# Altium schematic sheet I2C_Keypad.SchDoc
size B; Author: AM; CompanyName: Expatria Technologies; DrawnBy: A.Marles; Engineer: AM; Organization: Expatria Technologies; DocumentNumber: 13; Revision: A1; SheetNumber: 13; SheetTotal: 14; PCB_Rev: A1
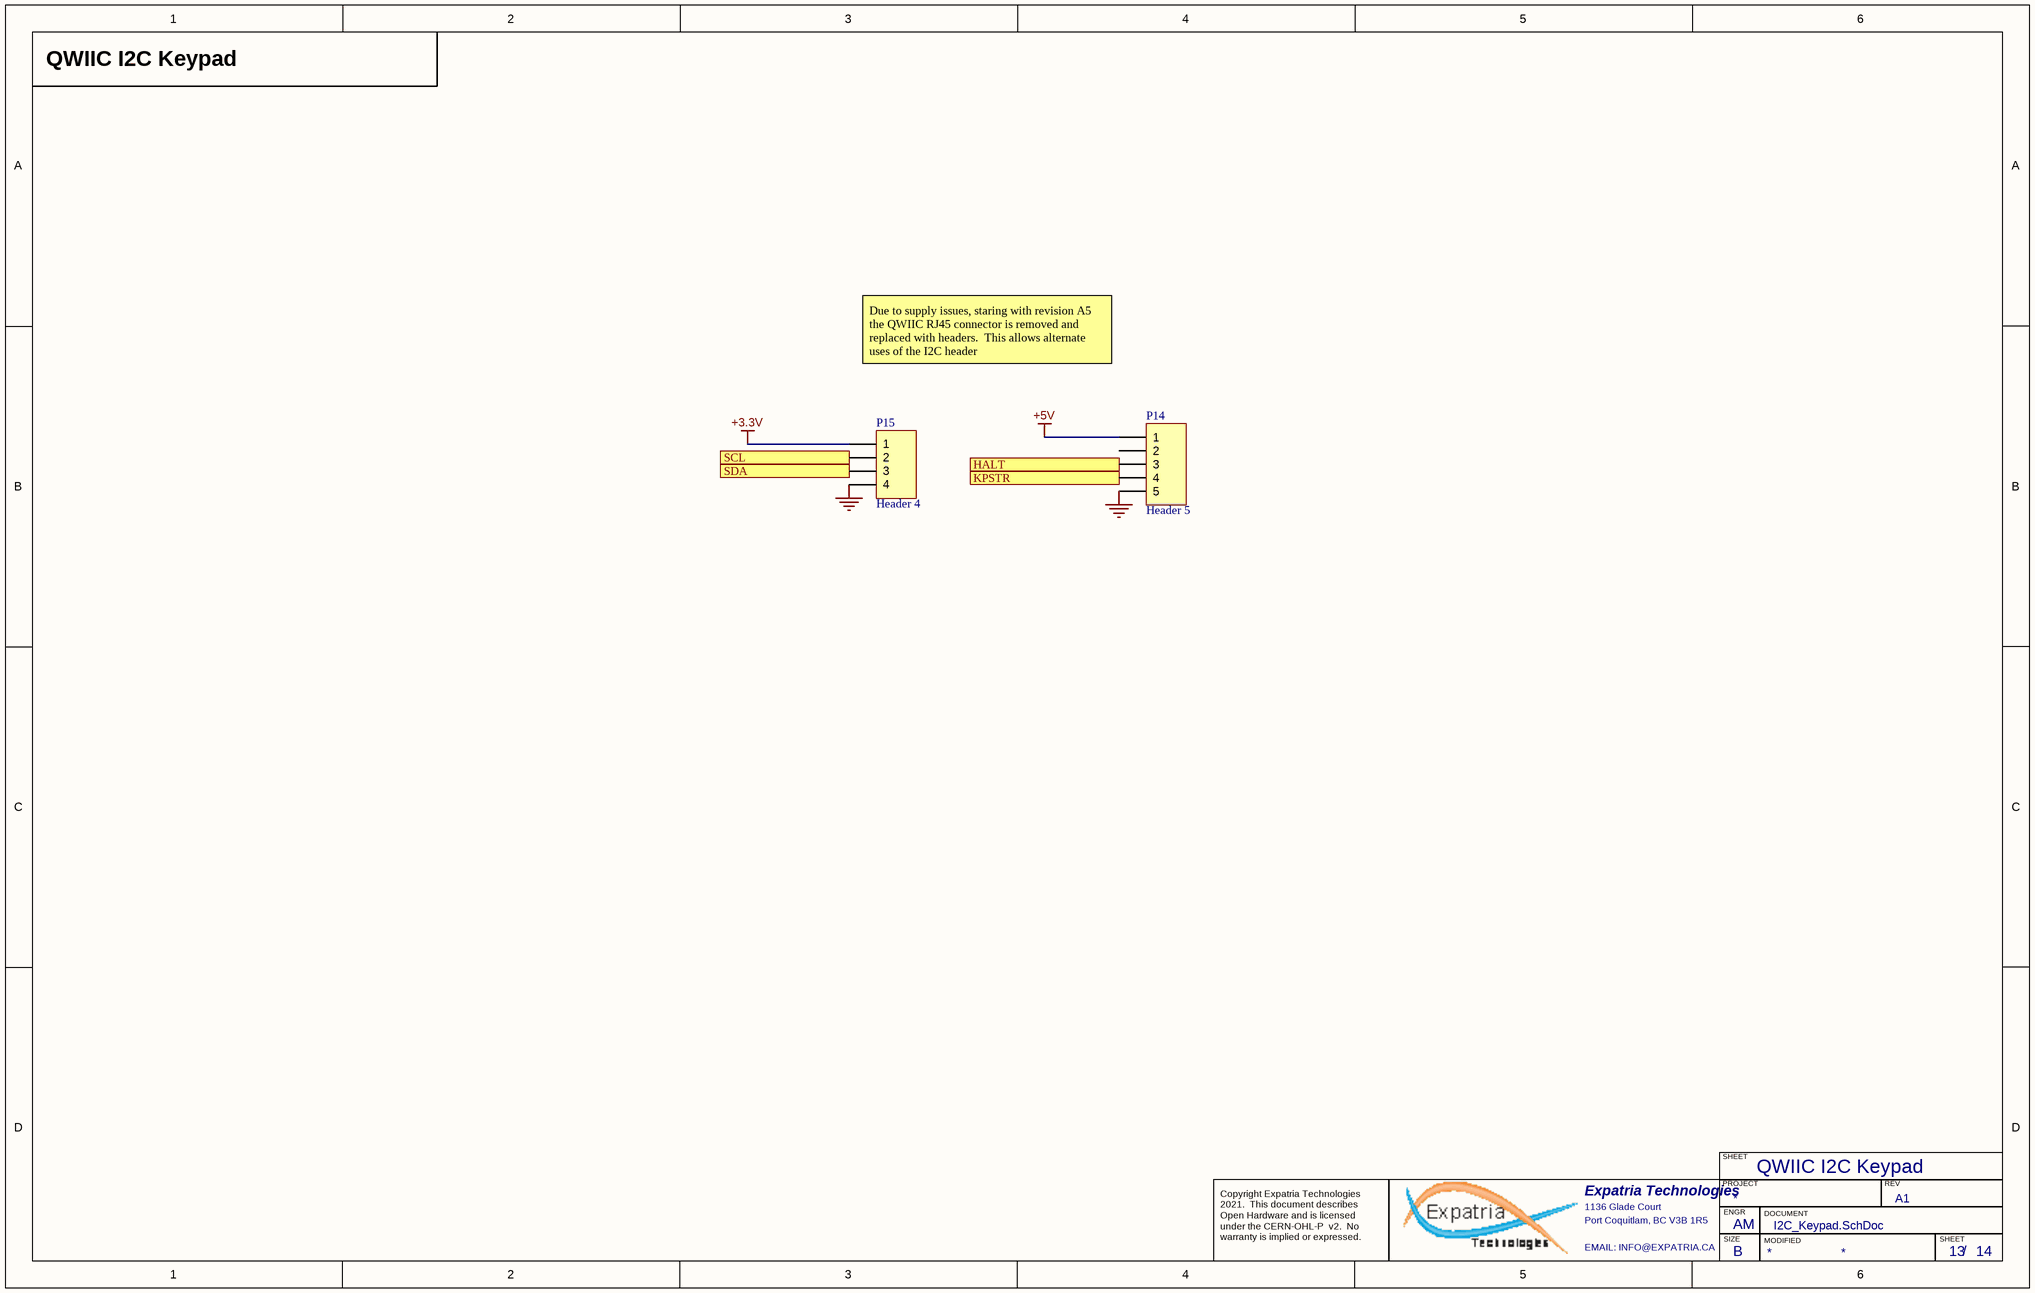
[diagram p0: I2C_Keypad.SchDoc]

## Parts
P14  Header 5  [HDR1X5]
P15  Header 4  [HDR1X4]

## Ports
HALT (out), KPSTR (out), SCL (in), SDA (in)

## Nets
+3.3V: P15.1
+5V: P14.1
GND: P14.5 P15.4
HALT: P14.3 ; port HALT
KPSTR: P14.4 ; port KPSTR
SCL: P15.2 ; port SCL
SDA: P15.3 ; port SDA

Not connected (* = marked no-connect by the designer): P14 2

## Notes on the sheet
- QWIIC I2C Keypad
- Due to supply issues, staring with revision A5 the QWIIC RJ45 connector is removed and replaced with headers.  This allows alternate uses of the I2C header
- SHEET
- Expatria Technologies
- 1136 Glade Court
- Port Coquitlam, BC V3B 1R5
- PROJECT
- SIZE
- ENGR
- MODIFIED
- DOCUMENT
- REV
- Copyright Expatria Technologies 2021.  This document describes Open Hardware and is licensed under the CERN-OHL-P  v2.  No warranty is implied or expressed.
- EMAIL: INFO@EXPATRIA.CA
- B
- /

## Library data of the parts
P14 = Header 5: Header, 5-Pin; LatestRevisionDate: 17-Jul-2002; LatestRevisionNote: Re-released for DXP Platform.; Publisher: Altium Limited; SuppliersPartNumber: C124379
P15 = Header 4: Header, 4-Pin; Publisher: Altium Limited; SuppliersPartNumber: C124378